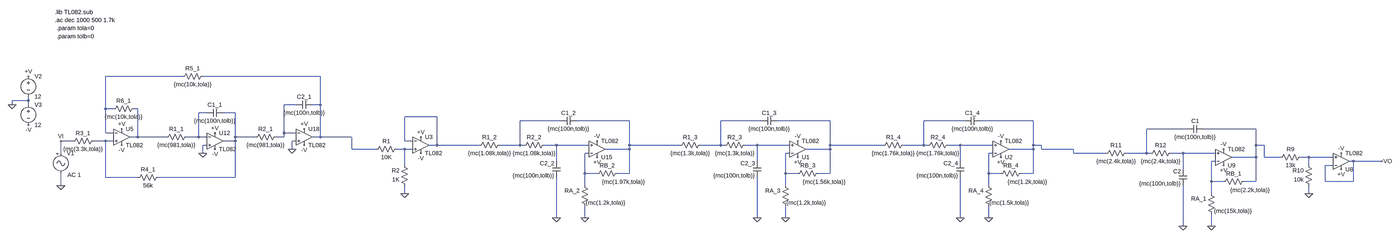
[diagram p0: schematic FiltroLP_RV2.asc, whole sheet]
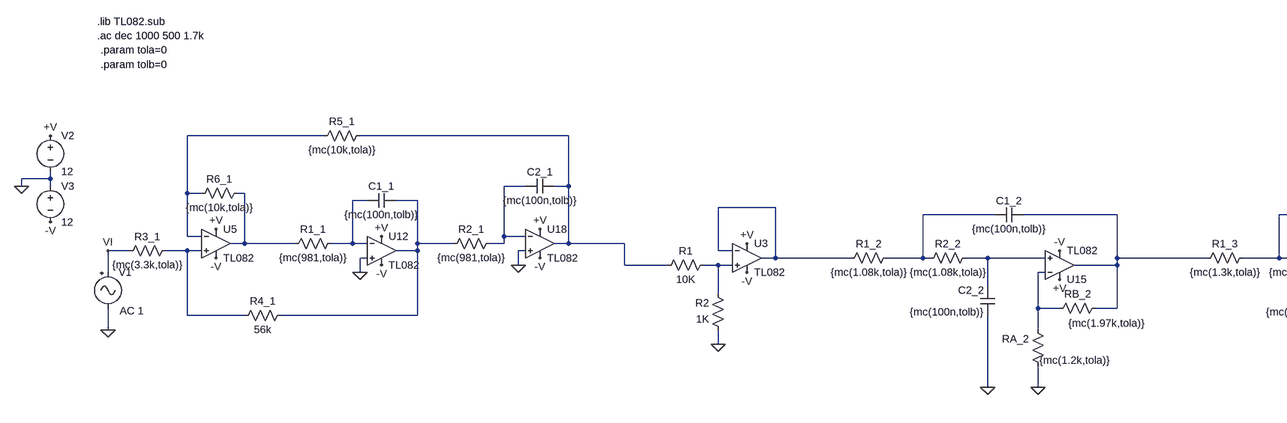
[diagram p1: schematic FiltroLP_RV2.asc, part, row 1 of 1, column 1 of 2]
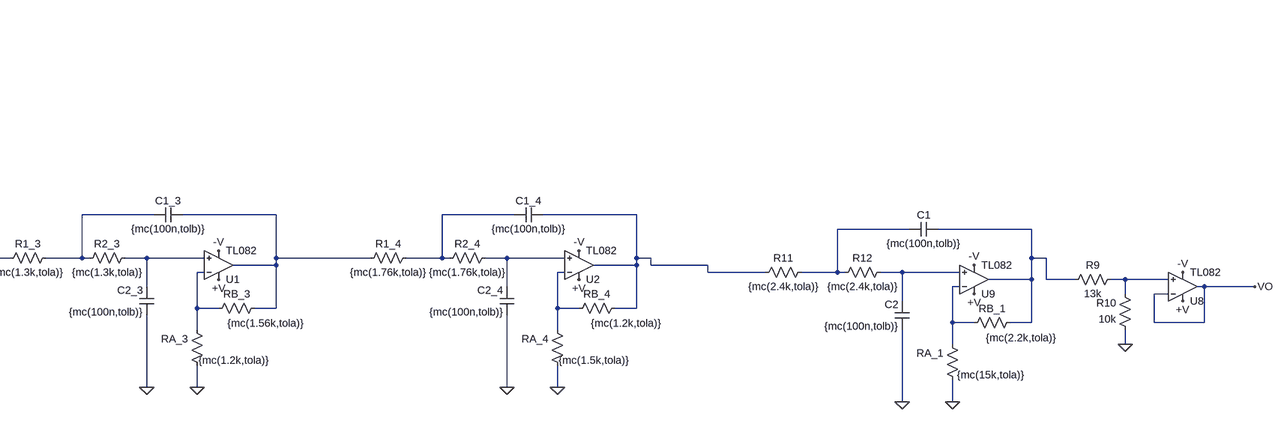
[diagram p2: schematic FiltroLP_RV2.asc, part, row 1 of 1, column 2 of 2]
FiltroLP_RV2.asc, the LTspice schematic file:
Version 4
SHEET 1 5208 1092
WIRE -912 0 -1216 0
WIRE -368 0 -832 0
WIRE -1520 96 -1520 80
WIRE -1520 96 -1584 96
WIRE -1584 112 -1584 96
WIRE -1520 112 -1520 96
WIRE -464 112 -512 112
WIRE -368 112 -368 0
WIRE -368 112 -400 112
WIRE -1216 128 -1216 0
WIRE -1184 128 -1216 128
WIRE -1088 128 -1104 128
WIRE -816 144 -848 144
WIRE -704 144 -752 144
WIRE 112 160 -16 160
WIRE 624 176 464 176
WIRE 896 176 688 176
WIRE 1824 176 1664 176
WIRE 2096 176 1888 176
WIRE 3072 176 2912 176
WIRE 3344 176 3136 176
WIRE 4224 208 4064 208
WIRE 4496 208 4288 208
WIRE -1216 224 -1216 128
WIRE -1184 224 -1216 224
WIRE -512 224 -512 112
WIRE -464 224 -512 224
WIRE -1088 240 -1088 128
WIRE -1088 240 -1120 240
WIRE -976 240 -1088 240
WIRE -848 240 -848 144
WIRE -848 240 -896 240
WIRE -816 240 -848 240
WIRE -704 240 -704 144
WIRE -624 240 -704 240
WIRE -512 240 -512 224
WIRE -512 240 -544 240
WIRE -368 240 -368 112
WIRE -368 240 -400 240
WIRE -224 240 -368 240
WIRE -1344 256 -1392 256
WIRE -1216 256 -1264 256
WIRE -1184 256 -1216 256
WIRE -704 256 -704 240
WIRE -704 256 -752 256
WIRE -464 256 -480 256
WIRE -16 256 -16 160
WIRE 16 256 -16 256
WIRE -816 272 -832 272
WIRE 112 272 112 160
WIRE 112 272 80 272
WIRE 304 272 112 272
WIRE 464 272 464 176
WIRE 464 272 384 272
WIRE 480 272 464 272
WIRE 608 272 560 272
WIRE 736 272 608 272
WIRE 896 272 896 176
WIRE 1504 272 896 272
WIRE 1664 272 1664 176
WIRE 1664 272 1584 272
WIRE 1680 272 1664 272
WIRE 1808 272 1760 272
WIRE 1936 272 1808 272
WIRE 2096 272 2096 176
WIRE 2752 272 2096 272
WIRE 2912 272 2912 176
WIRE 2912 272 2832 272
WIRE 2928 272 2912 272
WIRE 3056 272 3008 272
WIRE 3184 272 3056 272
WIRE 3344 272 3344 176
WIRE 3376 272 3344 272
WIRE 4496 272 4496 208
WIRE 4528 272 4496 272
WIRE -480 288 -480 256
WIRE -224 288 -224 240
WIRE -128 288 -224 288
WIRE -16 288 -48 288
WIRE 16 288 -16 288
WIRE 896 288 896 272
WIRE 896 288 800 288
WIRE 2096 288 2096 272
WIRE 2096 288 2000 288
WIRE 3344 288 3344 272
WIRE 3344 288 3248 288
WIRE 3376 288 3376 272
WIRE 3776 288 3376 288
WIRE -1392 304 -1392 256
WIRE -832 304 -832 272
WIRE 736 304 720 304
WIRE 1936 304 1920 304
WIRE 3184 304 3168 304
WIRE 3776 304 3776 288
WIRE 3904 304 3776 304
WIRE 4064 304 4064 208
WIRE 4064 304 3984 304
WIRE 4080 304 4064 304
WIRE 4208 304 4160 304
WIRE 4336 304 4208 304
WIRE 4496 320 4496 272
WIRE 4496 320 4400 320
WIRE 4528 320 4528 272
WIRE 4592 320 4528 320
WIRE 4704 320 4672 320
WIRE 4800 320 4704 320
WIRE 608 336 608 272
WIRE 1808 336 1808 272
WIRE 3056 336 3056 272
WIRE 4336 336 4320 336
WIRE 4880 336 4864 336
WIRE 4992 336 4880 336
WIRE -16 352 -16 288
WIRE 4704 352 4704 320
WIRE 4800 352 4768 352
WIRE 4208 368 4208 304
WIRE 720 384 720 304
WIRE 768 384 720 384
WIRE 896 384 896 288
WIRE 896 384 848 384
WIRE 1920 384 1920 304
WIRE 1968 384 1920 384
WIRE 2096 384 2096 288
WIRE 2096 384 2048 384
WIRE 3168 384 3168 304
WIRE 3216 384 3168 384
WIRE 3344 384 3344 288
WIRE 3344 384 3296 384
WIRE -1216 400 -1216 256
WIRE -1088 400 -1216 400
WIRE -704 400 -704 256
WIRE -704 400 -1008 400
WIRE 4320 416 4320 336
WIRE 4368 416 4320 416
WIRE 4496 416 4496 320
WIRE 4496 416 4448 416
WIRE 4768 416 4768 352
WIRE 4880 416 4880 336
WIRE 4880 416 4768 416
WIRE -1392 432 -1392 384
WIRE 720 432 720 384
WIRE 1920 432 1920 384
WIRE 3168 432 3168 384
WIRE -16 464 -16 432
WIRE 4320 464 4320 416
WIRE 4704 464 4704 432
WIRE 608 560 608 400
WIRE 720 560 720 512
WIRE 1808 560 1808 400
WIRE 1920 560 1920 512
WIRE 3056 560 3056 400
WIRE 3168 560 3168 512
WIRE 4208 592 4208 432
WIRE 4320 592 4320 544
FLAG 608 560 0
FLAG 720 560 0
FLAG -1392 256 VI
FLAG -1392 432 0
FLAG -832 304 0
FLAG -480 288 0
FLAG -1584 112 0
FLAG -1520 0 +V
FLAG -1520 192 -V
FLAG -1152 208 +V
FLAG -784 224 +V
FLAG -432 208 +V
FLAG -1152 272 -V
FLAG -784 288 -V
FLAG -432 272 -V
FLAG 768 320 +V
FLAG 768 256 -V
FLAG 1808 560 0
FLAG 1920 560 0
FLAG 1968 320 +V
FLAG 1968 256 -V
FLAG 3056 560 0
FLAG 3168 560 0
FLAG 3216 320 +V
FLAG 3216 256 -V
FLAG 4832 304 -V
FLAG 4832 368 +V
FLAG 4704 464 0
FLAG 4992 336 VO
FLAG 4208 592 0
FLAG 4320 592 0
FLAG 4368 352 +V
FLAG 4368 288 -V
FLAG 48 240 +V
FLAG 48 304 -V
FLAG -16 464 0
SYMBOL cap 688 160 R90
WINDOW 0 0 32 VBottom 2
WINDOW 3 32 32 VTop 2
SYMATTR InstName C1_2
SYMATTR Value {mc(100n,tolb)}
SYMBOL cap 624 400 R180
WINDOW 0 24 56 Left 2
WINDOW 3 24 8 Left 2
SYMATTR InstName C2_2
SYMATTR Value {mc(100n,tolb)}
SYMBOL res 288 288 R270
WINDOW 3 0 56 VBottom 2
WINDOW 0 32 56 VTop 2
SYMATTR Value {mc(1.08k,tola)}
SYMATTR InstName R1_2
SYMBOL res 864 368 R90
WINDOW 0 0 56 VBottom 2
WINDOW 3 34 -9 VTop 2
SYMATTR InstName RB_2
SYMATTR Value {mc(1.97k,tola)}
SYMBOL res 736 528 R180
WINDOW 0 36 76 Left 2
WINDOW 3 -144 28 Left 2
SYMATTR InstName RA_2
SYMATTR Value {mc(1.2k,tola)}
SYMBOL res 464 288 R270
WINDOW 0 32 56 VTop 2
WINDOW 3 0 56 VBottom 2
SYMATTR InstName R2_2
SYMATTR Value {mc(1.08k,tola)}
SYMBOL Misc\\signal -1392 288 R0
WINDOW 123 26 102 Left 2
WINDOW 39 0 0 Left 2
SYMATTR Value2 AC 1
SYMATTR InstName V1
SYMATTR Value ""
SYMBOL res -1088 112 R90
WINDOW 0 0 56 VBottom 2
WINDOW 3 32 56 VTop 2
SYMATTR InstName R6_1
SYMATTR Value {mc(10k,tola)}
SYMBOL res -1248 240 R90
WINDOW 0 0 56 VBottom 2
WINDOW 3 32 56 VTop 2
SYMATTR InstName R3_1
SYMATTR Value {mc(3.3k,tola)}
SYMBOL res -880 224 R90
WINDOW 0 0 56 VBottom 2
WINDOW 3 32 56 VTop 2
SYMATTR InstName R1_1
SYMATTR Value {mc(981,tola)}
SYMBOL cap -752 128 R90
WINDOW 0 0 32 VBottom 2
WINDOW 3 32 32 VTop 2
SYMATTR InstName C1_1
SYMATTR Value {mc(100n,tolb)}
SYMBOL cap -400 96 R90
WINDOW 0 0 32 VBottom 2
WINDOW 3 32 32 VTop 2
SYMATTR InstName C2_1
SYMATTR Value {mc(100n,tolb)}
SYMBOL res -528 224 R90
WINDOW 0 0 56 VBottom 2
WINDOW 3 32 56 VTop 2
SYMATTR InstName R2_1
SYMATTR Value {mc(981,tola)}
SYMBOL res -992 384 R90
WINDOW 0 0 56 VBottom 2
WINDOW 3 32 56 VTop 2
SYMATTR InstName R4_1
SYMATTR Value 56k
SYMBOL res -816 -16 R90
WINDOW 0 0 56 VBottom 2
WINDOW 3 32 56 VTop 2
SYMATTR InstName R5_1
SYMATTR Value {mc(10k,tola)}
SYMBOL Opamps\\opamp2 -1152 176 R0
SYMATTR InstName U5
SYMATTR Value TL082
SYMBOL Opamps\\opamp2 -784 192 R0
SYMATTR InstName U12
SYMATTR Value TL082
SYMBOL Opamps\\opamp2 -432 176 R0
SYMATTR InstName U18
SYMATTR Value TL082
SYMBOL voltage -1520 -16 R0
WINDOW 123 0 0 Left 2
WINDOW 39 0 0 Left 2
SYMATTR InstName V2
SYMATTR Value 12
SYMBOL voltage -1520 96 R0
WINDOW 123 0 0 Left 2
WINDOW 39 0 0 Left 2
SYMATTR InstName V3
SYMATTR Value 12
SYMBOL Opamps\\opamp2 768 352 M180
SYMATTR InstName U15
SYMATTR Value TL082
SYMBOL cap 1888 160 R90
WINDOW 0 0 32 VBottom 2
WINDOW 3 32 32 VTop 2
SYMATTR InstName C1_3
SYMATTR Value {mc(100n,tolb)}
SYMBOL cap 1824 400 R180
WINDOW 0 24 56 Left 2
WINDOW 3 24 8 Left 2
SYMATTR InstName C2_3
SYMATTR Value {mc(100n,tolb)}
SYMBOL res 1488 288 R270
WINDOW 3 0 56 VBottom 2
WINDOW 0 32 56 VTop 2
SYMATTR Value {mc(1.3k,tola)}
SYMATTR InstName R1_3
SYMBOL res 2064 368 R90
WINDOW 0 0 56 VBottom 2
WINDOW 3 34 -9 VTop 2
SYMATTR InstName RB_3
SYMATTR Value {mc(1.56k,tola)}
SYMBOL res 1936 528 R180
WINDOW 0 36 76 Left 2
WINDOW 3 -144 28 Left 2
SYMATTR InstName RA_3
SYMATTR Value {mc(1.2k,tola)}
SYMBOL res 1664 288 R270
WINDOW 0 32 56 VTop 2
WINDOW 3 0 56 VBottom 2
SYMATTR InstName R2_3
SYMATTR Value {mc(1.3k,tola)}
SYMBOL Opamps\\opamp2 1968 352 M180
SYMATTR InstName U1
SYMATTR Value TL082
SYMBOL cap 3136 160 R90
WINDOW 0 0 32 VBottom 2
WINDOW 3 32 32 VTop 2
SYMATTR InstName C1_4
SYMATTR Value {mc(100n,tolb)}
SYMBOL cap 3072 400 R180
WINDOW 0 24 56 Left 2
WINDOW 3 24 8 Left 2
SYMATTR InstName C2_4
SYMATTR Value {mc(100n,tolb)}
SYMBOL res 2736 288 R270
WINDOW 3 0 56 VBottom 2
WINDOW 0 32 56 VTop 2
SYMATTR Value {mc(1.76k,tola)}
SYMATTR InstName R1_4
SYMBOL res 3312 368 R90
WINDOW 0 0 56 VBottom 2
WINDOW 3 34 -9 VTop 2
SYMATTR InstName RB_4
SYMATTR Value {mc(1.2k,tola)}
SYMBOL res 3184 528 R180
WINDOW 0 36 76 Left 2
WINDOW 3 -144 28 Left 2
SYMATTR InstName RA_4
SYMATTR Value {mc(1.5k,tola)}
SYMBOL res 2912 288 R270
WINDOW 0 32 56 VTop 2
WINDOW 3 0 56 VBottom 2
SYMATTR InstName R2_4
SYMATTR Value {mc(1.76k,tola)}
SYMBOL Opamps\\opamp2 3216 352 M180
SYMATTR InstName U2
SYMATTR Value TL082
SYMBOL Opamps\\opamp2 4832 400 M180
SYMATTR InstName U8
SYMATTR Value TL082
SYMBOL res 4688 304 R90
WINDOW 0 0 56 VBottom 2
WINDOW 3 32 56 VTop 2
SYMATTR InstName R9
SYMATTR Value 13k
SYMBOL res 4720 448 R180
WINDOW 0 36 76 Left 2
WINDOW 3 36 40 Left 2
SYMATTR InstName R10
SYMATTR Value 10k
SYMBOL cap 4288 192 R90
WINDOW 0 0 32 VBottom 2
WINDOW 3 32 32 VTop 2
SYMATTR InstName C1
SYMATTR Value {mc(100n,tolb)}
SYMBOL cap 4224 432 R180
WINDOW 0 24 56 Left 2
WINDOW 3 24 8 Left 2
SYMATTR InstName C2
SYMATTR Value {mc(100n,tolb)}
SYMBOL res 3888 320 R270
WINDOW 3 0 56 VBottom 2
WINDOW 0 32 56 VTop 2
SYMATTR Value {mc(2.4k,tola)}
SYMATTR InstName R11
SYMBOL res 4464 400 R90
WINDOW 0 0 56 VBottom 2
WINDOW 3 34 -9 VTop 2
SYMATTR InstName RB_1
SYMATTR Value {mc(2.2k,tola)}
SYMBOL res 4336 560 R180
WINDOW 0 36 76 Left 2
WINDOW 3 -144 28 Left 2
SYMATTR InstName RA_1
SYMATTR Value {mc(15k,tola)}
SYMBOL res 4064 320 R270
WINDOW 0 32 56 VTop 2
WINDOW 3 0 56 VBottom 2
SYMATTR InstName R12
SYMATTR Value {mc(2.4k,tola)}
SYMBOL Opamps\\opamp2 4368 384 M180
SYMATTR InstName U9
SYMATTR Value TL082
SYMBOL Opamps\\opamp2 48 208 R0
SYMATTR InstName U3
SYMATTR Value TL082
SYMBOL res -32 272 R90
WINDOW 0 0 56 VBottom 2
WINDOW 3 32 56 VTop 2
SYMATTR InstName R1
SYMATTR Value 10K
SYMBOL res 0 448 R180
WINDOW 0 36 76 Left 2
WINDOW 3 36 40 Left 2
SYMATTR InstName R2
SYMATTR Value 1K
TEXT -1416 -256 Left 2 !.ac dec 1000 500 1.7k
TEXT -1416 -288 Left 2 !.lib TL082.sub
TEXT -1408 -224 Left 2 !.param tola=0
TEXT -1408 -192 Left 2 !.param tolb=0

The netlist it stands for:
* FiltroLP_RV2.asc
C1_2 N009 N008 {mc(100n,tolb)}
C2_2 0 N017 {mc(100n,tolb)}
R1_2 N007 N008 {mc(1.08k,tola)}
RB_2 N009 N021 {mc(1.97k,tola)}
RA_2 0 N021 {mc(1.2k,tola)}
R2_2 N008 N017 {mc(1.08k,tola)}
V1 VI 0 AC 1
R6_1 N004 N001 {mc(10k,tola)}
R3_1 N016 VI {mc(3.3k,tola)}
R1_1 N005 N004 {mc(981,tola)}
C1_1 N006 N005 {mc(100n,tolb)}
C2_1 N002 N003 {mc(100n,tolb)}
R2_1 N003 N006 {mc(981,tola)}
R4_1 N006 N016 56k
R5_1 N002 N001 {mc(10k,tola)}
XU5 N016 N001 +V -V N004 TL082  ; pins In+ In- V+ V- OUT
XU12 0 N005 +V -V N006 TL082  ; pins In+ In- V+ V- OUT
XU18 0 N003 +V -V N002 TL082  ; pins In+ In- V+ V- OUT
V2 +V 0 12
V3 0 -V 12
XU15 N017 N021 +V -V N009 TL082  ; pins In+ In- V+ V- OUT
C1_3 N011 N010 {mc(100n,tolb)}
C2_3 0 N018 {mc(100n,tolb)}
R1_3 N009 N010 {mc(1.3k,tola)}
RB_3 N011 N022 {mc(1.56k,tola)}
RA_3 0 N022 {mc(1.2k,tola)}
R2_3 N010 N018 {mc(1.3k,tola)}
XU1 N018 N022 +V -V N011 TL082  ; pins In+ In- V+ V- OUT
C1_4 N013 N012 {mc(100n,tolb)}
C2_4 0 N019 {mc(100n,tolb)}
R1_4 N011 N012 {mc(1.76k,tola)}
RB_4 N013 N023 {mc(1.2k,tola)}
RA_4 0 N023 {mc(1.5k,tola)}
R2_4 N012 N019 {mc(1.76k,tola)}
XU2 N019 N023 +V -V N013 TL082  ; pins In+ In- V+ V- OUT
XU8 N025 VO +V -V VO TL082  ; pins In+ In- V+ V- OUT
R9 N025 N015 13k
R10 0 N025 10k
C1 N015 N014 {mc(100n,tolb)}
C2 0 N024 {mc(100n,tolb)}
R11 N013 N014 {mc(2.4k,tola)}
RB_1 N015 N026 {mc(2.2k,tola)}
RA_1 0 N026 {mc(15k,tola)}
R12 N014 N024 {mc(2.4k,tola)}
XU9 N024 N026 +V -V N015 TL082  ; pins In+ In- V+ V- OUT
XU3 N020 N007 +V -V N007 TL082  ; pins In+ In- V+ V- OUT
R1 N020 N002 10K
R2 0 N020 1K
.ac dec 1000 500 1.7k
.lib TL082.sub
.param tola=0
.param tolb=0
.backanno
.end